# Altium project LEDLights.PrjPcb
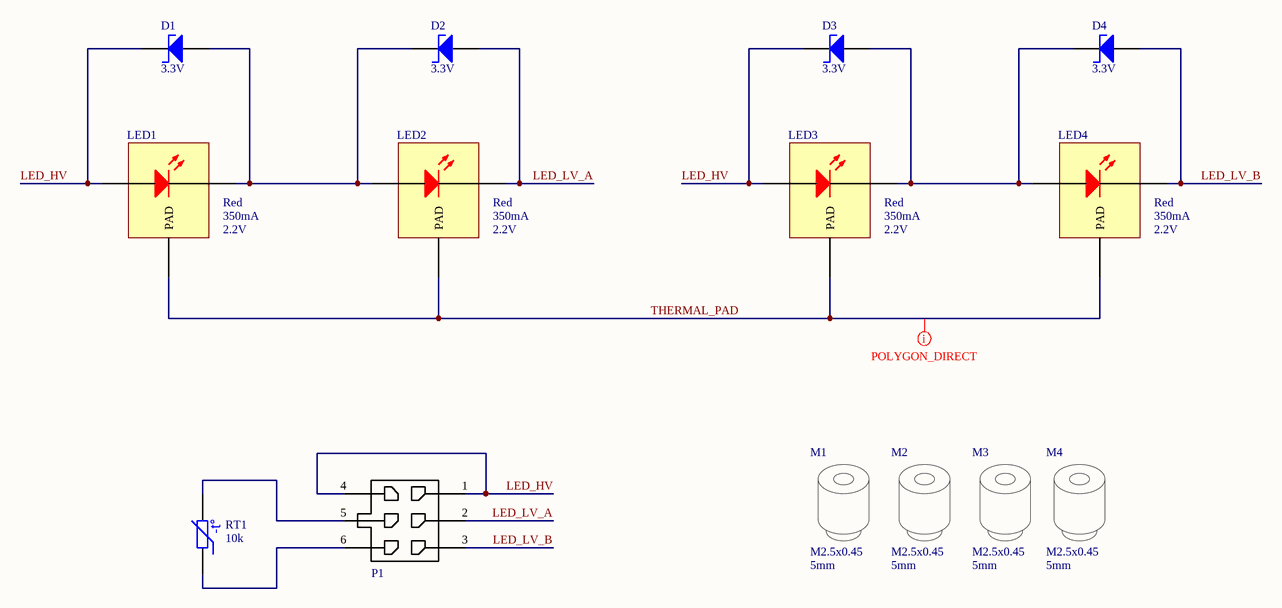
[diagram p0: LEDLights.SchDoc]
ProjectAuthor: Nita E & Pei Liang Guo; ProjectRevision: 4.0; SheetTotal: 1
1 sheet, 14 parts. Net scope: global (net labels, ports and power ports of the same name join across sheets).
Board file: LEDLights.PcbDoc

## Sheet LEDLights.SchDoc: LED Lights
size Letter; Organization: Midnight Sun Solar Rayce Car Team; Address1: University of Waterloo; Address2: 200 University Ave W; Address3: Waterloo, ON, Canada; Address4: N2L 3E9; SheetNumber: 1; SheetTotal: 1; Website: www.uwmidsun.com

### Parts
D1  Zener Voltage: 3.3V  [DO-214AA Diode]  (hidden comment: DIODE ZENER 3.3V 3W DO-214AA)
D2  Zener Voltage: 3.3V  [DO-214AA Diode]  (hidden comment: DIODE ZENER 3.3V 3W DO-214AA)
D3  Zener Voltage: 3.3V  [DO-214AA Diode]  (hidden comment: DIODE ZENER 3.3V 3W DO-214AA)
D4  Zener Voltage: 3.3V  [DO-214AA Diode]  (hidden comment: DIODE ZENER 3.3V 3W DO-214AA)
LED1  Color: Red  Test Current: 350mA  Forward Voltage: 2.2V  [LED XLAMP XP-E2 1414]  (hidden comment: LED RED XLAMP XP-E2 1414)
LED2  Color: Red  Test Current: 350mA  Forward Voltage: 2.2V  [LED XLAMP XP-E2 1414]  (hidden comment: LED RED XLAMP XP-E2 1414)
LED3  Color: Red  Test Current: 350mA  Forward Voltage: 2.2V  [LED XLAMP XP-E2 1414]  (hidden comment: LED RED XLAMP XP-E2 1414)
LED4  Color: Red  Test Current: 350mA  Forward Voltage: 2.2V  [LED XLAMP XP-E2 1414]  (hidden comment: LED RED XLAMP XP-E2 1414)
M1  Screw-Thread Size: M2.5x0.45  Standoff Height: 5mm  [M2.5 Standoff]  (hidden comment: STANDOFF RND M2.5X0.45 STEEL 5MM)
M2  Screw-Thread Size: M2.5x0.45  Standoff Height: 5mm  [M2.5 Standoff]  (hidden comment: STANDOFF RND M2.5X0.45 STEEL 5MM)
M3  Screw-Thread Size: M2.5x0.45  Standoff Height: 5mm  [M2.5 Standoff]  (hidden comment: STANDOFF RND M2.5X0.45 STEEL 5MM)
M4  Screw-Thread Size: M2.5x0.45  Standoff Height: 5mm  [M2.5 Standoff]  (hidden comment: STANDOFF RND M2.5X0.45 STEEL 5MM)
P1  CONN 6POS MICRO-FIT 2ROW 3mm  [CONN, 6POS MICRO-FIT]  (value not drawn)
RT1  Resistance in Ohms @ 25°C: 10k  [RES, 0603]  (hidden comment: NTC THERMISTORS 10K 0603 SMD)

### Nets
LED_HV: D1.2(K) D3.2(K) LED1.1(A) LED3.1(A) P1.1 P1.4
LED_LV_A: D2.1(A) LED2.3(K) P1.2
LED_LV_B: D4.1(A) LED4.3(K) P1.3
THERMAL_PAD: LED1.2(PAD) LED2.2(PAD) LED3.2(PAD) LED4.2(PAD)
NetD1_1: D1.1(A) D2.2(K) LED1.3(K) LED2.1(A)
NetD3_1: D3.1(A) D4.2(K) LED3.3(K) LED4.1(A)
NetP1_5: P1.5 RT1.2
NetP1_6: P1.6 RT1.1

### Layout directives
mark named POLYGON_DIRECT: THERMAL_PAD

### Notes on the sheet
- Project:
- Title:
- Size:
- Project Author
- Letter
- Revision:
- University of Waterloo
- 200 University Ave W
- Waterloo, ON, Canada
- N2L 3E9
- Date:
- Sheet
- of
- Website:
- (in symbol NTC THERMISTORS 10K 0603 SMD) -t°

### Library data of the parts
D1-D4 = DIODE ZENER 3.3V 3W DO-214AA: Diode Zener Single 3.3V 5% 3000mW Automotive 2-Pin SMB T/R; Manufacturer: ON Semiconductor; Manufacturer Part Number: SZ1SMB5913BT3G; Max Power Dissipation: 550mW; Zener Current: 100uA; Forward Voltage: 1.5V; Impedance: 10R; Test Current: 113.6mA; Supplier 1: Digi-Key; RoHS: Yes; Category: Zener Diodes; Stock 1: 2894; Pricing 1: 1=0.62000, 10=0.54500, 25=0.51160, 100=0.37130, 250=0.35804, 500=0.31020, 1000=0.26400 (USD); Case/Package: SMB; Number of Pins: 2; Min Operating Temperature: -65°C; Max Operating Temperature: 150°C; Tolerance: 5%; Package Quantity: 2500; Peak Reverse Current: 100uA; Voltage Tolerance: 5%; Power Dissipation: 550mW; Max Reverse Leakage Current: 100uA; Element Configuration: Single; Packaging: Tape and Reel; Length: 4.32mm; Height: 2.3mm; Width: 3.56mm; Radiation Hardening: No; Lead Free: Lead Free; Halogen Free: Halogen Free; ComponentLink1URL: http://www.mouser.com/ds/2/308/1SMB5913BT3-D-108682.pdf?src-supplier=Mouser; ComponentLink1Description: http://www.mouser.com/ds/2/308/1SMB5913BT3-D-108682.pdf?src-supplier=Mouser; ComponentLink2URL: https://www.onsemi.com/pub/Collateral/1SMB5913BT3-D.PDF?src-supplier=Digi-Key; ComponentLink2Description: https://www.onsemi.com/pub/Collateral/1SMB5913BT3-D.PDF?src-supplier=Digi-Key; ComponentLink3URL: http://www.farnell.com/datasheets/2160707.pdf?src-supplier=Newark; ComponentLink3Description: http://www.farnell.com/datasheets/2160707.pdf?src-supplier=Newark; ComponentLink4URL: http://www.onsemi.com/pub/Collateral/1SMB5913BT3-D.PDF?src-supplier=Avnet; ComponentLink4Description: http://www.onsemi.com/pub/Collateral/1SMB5913BT3-D.PDF?src-supplier=Avnet; Supplier Part Number 1: SZ1SMB5913BT3GOSCT-ND
LED1-LED4 = LED RED XLAMP XP-E2 1414: LED Lighting Color XLamp® XP-E2 Red 623nm (620nm ~ 625nm) 1414 (3535 Metric); Manufacturer: Cree; Manufacturer Part Number: XPEBRD-L1-0000-00902; Max Current Rating: 1A; Test Temperature: 25°C; Viewing Angle: 130°; Thermal Resistance of Package: 5°C/W; Supplier 1: Digi-Key; Stock 1: 1640; Pricing 1: 1 = 2.00000, 10 = 1.90000, 100 = 1.69980, 250 = 1.54584, 500 = 1.44786 (USD); Mount: Surface Mount; Case/Package: SMD/SMT; Packaging: Tape and Reel; Wavelength: 625nm; Lead Free: Lead Free; Supplier Part Number 1: XPEBRD-L1-0000-00902CT-ND; RoHS: Yes
M1-M4 = STANDOFF RND M2.5X0.45 STEEL 5MM: Manufacturer: Wurth Electronics; Manufacturer Part Number: 9774050151R; Plating: Tin; Threaded/Unthreaded: Threaded; Outside Diameter: 0.201inch; Supplier 1: Digi-Key; RoHS: Yes; Stock 1: 24846; Pricing 1: 1 = 1.09000, 10 = 1.03000, 50 = 0.91800, 100 = 0.84000 (USD); Material: Steel; Length: 0.252inch; REACH SVHC: Unknown; Supplier Part Number 1: 732-7095-1-ND
P1 = CONN 6POS MICRO-FIT 2ROW 3mm: Header; 2 Row; Vertical; Polarizing Peg; 6 Pin; Tin Plate; SMT/Glow Wire; Kinked Leads; Manufacturer: Molex; Manufacturer Part Number: 0430450612; Number of Positions: 6; Number of Ports: 1; Contact Resistance: 10mR; Connector Type: Male Pin; Max Voltage Rating (AC): 250V; Row Spacing: 0.118inch; Supplier 1: Digi-Key; RoHS: Yes; Category: Headers and Wire Housings; Stock 1: 8467; Pricing 1: 1=1.33000, 10=1.17000, 100=1.00960, 500=0.82602, 1000=0.73424, 5000=0.64246, 10000=0.61034 (USD); Mount: Through Hole; Housing Material: Polymer; Housing Color: Black; Contact Material: Brass; Contact Plating: Tin; Color: Black; Number of Terminals: 6; Min Operating Temperature: -40°C; Max Operating Temperature: 105°C; Orientation: Straight; Termination: Solder; Number of Contacts: 6; Packaging: Tray; Number of Rows: 2; Fastening Type: Ramp; Length: 13.15mm; Pitch: 3mm; Depth: 8.77mm; Flammability Rating: UL94 V-0; ComponentLink1URL: https://datasheet.ciiva.com/6814/430450612-sd-6814051.pdf?src-supplier=Digi-Key; ComponentLink1Description: https://datasheet.ciiva.com/6814/430450612-sd-6814051.pdf?src-supplier=Digi-Key; ComponentLink2URL: https://datasheet.ciiva.com/16498/0430450612-pcb-headers-16498085.pdf?src-supplier=Avnet+Asia; ComponentLink2Description: https://datasheet.ciiva.com/16498/0430450612-pcb-headers-16498085.pdf?src-supplier=Avnet+Asia; ComponentLink3URL: https://datasheet.ciiva.com/3933/94170430450612-pcb-headers-3933226.pdf?src-supplier=Arrow; ComponentLink3Description: https://datasheet.ciiva.com/3933/94170430450612-pcb-headers-3933226.pdf?src-supplier=Arrow; Supplier Part Number 1: WM1791-ND
RT1 = NTC THERMISTORS 10K 0603 SMD: NTC THERMISTORS 10KOHM 1608 SMD; Manufacturer: Murata Electronics North America; Manufacturer Part Number: NCU18XH103F60RB; Resistance Tolerance: ±1%; B25/50: 3380K; B25/85: 3434K; B25/100: 3455K; Supplier 1: Digi-Key; RoHS: Request Inventory Verification; Category: Sensors, Transducers; Stock 1: 0; Pricing 1: 4000=0.06771, 8000=0.05974, 12000=0.05775, 20000=0.05675, 28000=0.05576 (CAD); Packaging: Tape & Reel (TR); Part Status: Active; B Value Tolerance: ±1%; B0/50: -; B25/75: -; Operating Temperature: -40°C ~ 125°C; Length - Lead Wire: -; Mounting Type: Surface Mount; Package / Case: 0603 (1608 Metric); ComponentLink1URL: https://www.murata.com/~/media/webrenewal/support/library/catalog/products/thermistor/r03e.ashx; ComponentLink1Description: https://www.murata.com/~/media/webrenewal/support/library/catalog/products/thermistor/r03e.ashx; Supplier Part Number 1: 490-16279-2-ND

## Assembly variants
01 - Tail Lights: all parts fitted